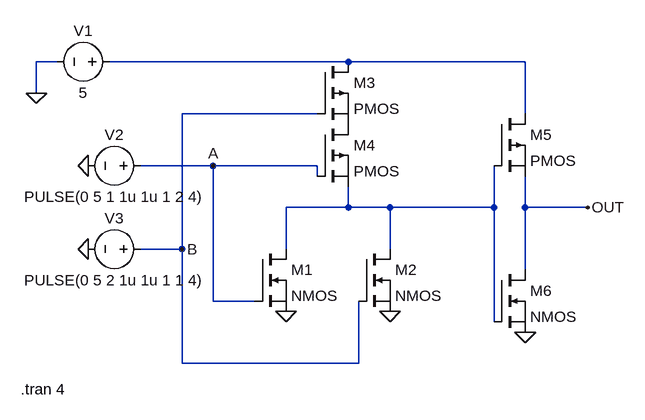
[diagram p0: schematic OR.asc]
OR.asc, the LTspice schematic file:
Version 4.1
SHEET 1 880 680
WIRE -128 -16 -160 -16
WIRE 320 -16 -48 -16
WIRE 592 -16 320 -16
WIRE -160 32 -160 -16
WIRE 272 64 64 64
WIRE 592 64 592 -16
WIRE 112 144 0 144
WIRE 272 144 112 144
WIRE 272 160 272 144
WIRE 320 208 320 176
WIRE 320 208 224 208
WIRE 384 208 320 208
WIRE 544 208 544 144
WIRE 544 208 384 208
WIRE 592 208 592 160
WIRE 688 208 592 208
WIRE 64 272 64 64
WIRE 64 272 0 272
WIRE 224 272 224 208
WIRE 384 272 384 208
WIRE 592 304 592 208
WIRE 112 352 112 144
WIRE 176 352 112 352
WIRE 544 384 544 208
WIRE 64 448 64 272
WIRE 336 448 336 352
WIRE 336 448 64 448
FLAG -160 32 0
FLAG -80 144 0
FLAG -80 272 0
FLAG 112 144 A
FLAG 64 272 B
FLAG 592 400 0
FLAG 224 368 0
FLAG 384 368 0
FLAG 688 208 OUT
SYMBOL voltage -32 -16 R90
WINDOW 0 -32 56 VBottom 2
WINDOW 3 32 56 VTop 2
WINDOW 123 0 0 Left 0
WINDOW 39 0 0 Left 0
SYMATTR InstName V1
SYMATTR Value 5
SYMBOL voltage 16 144 R90
WINDOW 0 -32 56 VBottom 2
WINDOW 3 32 56 VTop 2
WINDOW 123 0 0 Left 0
WINDOW 39 0 0 Left 0
SYMATTR InstName V2
SYMATTR Value PULSE(0 5 1 1u 1u 1 2 4)
SYMBOL voltage 16 272 R90
WINDOW 0 -32 56 VBottom 2
WINDOW 3 32 56 VTop 2
WINDOW 123 0 0 Left 0
WINDOW 39 0 0 Left 0
SYMATTR InstName V3
SYMATTR Value PULSE(0 5 2 1u 1u 1 1 4)
SYMBOL pmos 544 64 R0
SYMATTR InstName M5
SYMBOL nmos 544 304 R0
SYMATTR InstName M6
SYMBOL nmos 176 272 R0
SYMATTR InstName M1
SYMBOL nmos 336 272 R0
SYMATTR InstName M2
SYMBOL pmos 272 -16 R0
SYMATTR InstName M3
SYMBOL pmos 272 80 R0
SYMATTR InstName M4
TEXT -184 488 Left 2 !.tran 4

The netlist it stands for:
* OR.asc
V1 N001 0 5
V2 A 0 PULSE(0 5 1 1u 1u 1 2 4)
V3 B 0 PULSE(0 5 2 1u 1u 1 1 4)
M5 N001 N002 OUT OUT PMOS
M6 OUT N002 0 0 NMOS
M1 N002 A 0 0 NMOS
M2 N002 B 0 0 NMOS
M3 N001 B P001 P001 PMOS
M4 P001 A N002 N002 PMOS
.model NMOS NMOS
.model PMOS PMOS
.lib standard.mos
.tran 4
.backanno
.end